# EAGLE design uMouse (EAGLE 9.3.0)
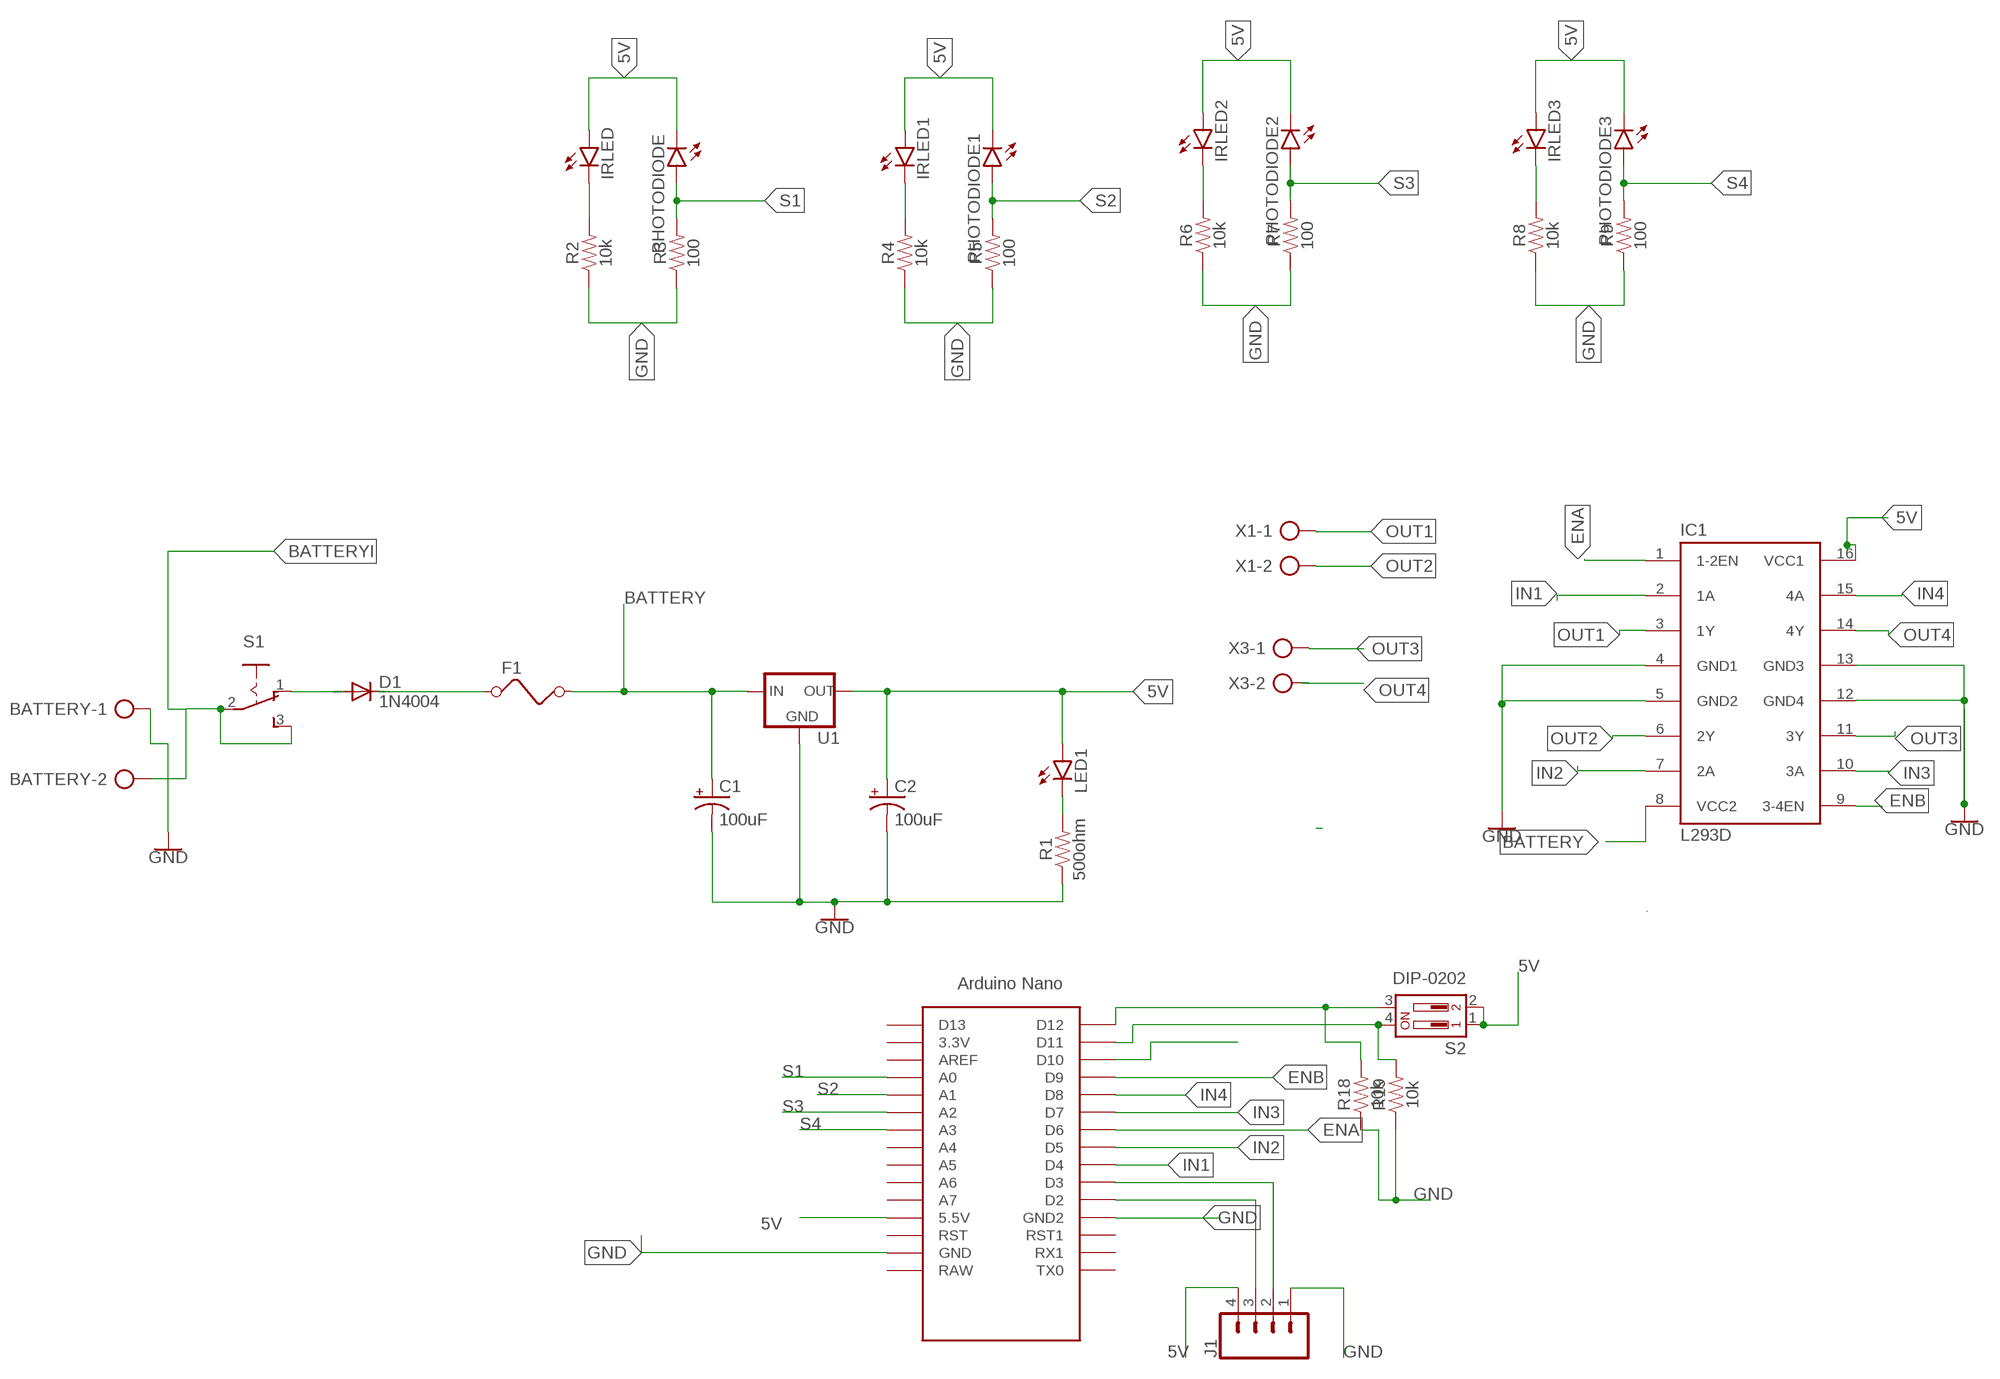
[diagram p0: schematic, sheet 1]

## Parts
BATTERY  AK500/2-H  [AK500/2-H]
C1  100uF  100UF-POLAR-RADIAL-2.5MM-25V-20%  [CPOL-RADIAL-2.5MM-6.5MM]
C2  100uF  100UF-POLAR-RADIAL-2.5MM-25V-20%  [CPOL-RADIAL-2.5MM-6.5MM]
D1  1N4004  [DO41-10]
F1  FUSE  [FUSE]
IC1  L293D  [DIL16]
IRLED  LED5MM  [LED5MM]
IRLED1  LED5MM  [LED5MM]
IRLED2  LED5MM  [LED5MM]
IRLED3  LED5MM  [LED5MM]
J1  CONN_04  [1X04]
LED1  LED3MM  [LED3MM]
PHOTODIODE  LED5MM  [LED5MM]
PHOTODIODE1  LED5MM  [LED5MM]
PHOTODIODE2  LED5MM  [LED5MM]
PHOTODIODE3  LED5MM  [LED5MM]
R1  500ohm  10MOHM-HORIZ-1/4W-5%  [AXIAL-0.3]
R2  10k  10MOHM-HORIZ-1/4W-5%  [AXIAL-0.3]
R3  100  10MOHM-HORIZ-1/4W-5%  [AXIAL-0.3]
R4  10k  10MOHM-HORIZ-1/4W-5%  [AXIAL-0.3]
R5  100  10MOHM-HORIZ-1/4W-5%  [AXIAL-0.3]
R6  10k  10MOHM-HORIZ-1/4W-5%  [AXIAL-0.3]
R7  100  10MOHM-HORIZ-1/4W-5%  [AXIAL-0.3]
R8  10k  10MOHM-HORIZ-1/4W-5%  [AXIAL-0.3]
R9  100  10MOHM-HORIZ-1/4W-5%  [AXIAL-0.3]
R18  10k  10MOHM-HORIZ-1/4W-5%  [AXIAL-0.3]
R19  10k  10MOHM-HORIZ-1/4W-5%  [AXIAL-0.3]
S1  255SB  [255SB]
S2  DIP-0202  [DIPSWITCH-02]
U1  78XXS  [78XXS]
U$2  NANO  [NANO]
X1  AK500/2-H  [AK500/2-H]
X3  AK500/2-H  [AK500/2-H]

## Nets
5V: C2.1(+) IC1.16(VCC1) IRLED1.A IRLED2.A IRLED3.A IRLED.A J1.4 LED1.A PHOTODIODE1.K(C) PHOTODIODE2.K(C) PHOTODIODE3.K(C) PHOTODIODE.K(C) S2.1 S2.2 U1.OUT U$2.5V(5.5V)
BATTERY: C1.1(+) F1.2 IC1.8(VCC2) U1.IN
BATTERYI: BATTERY.2 S1.2(P) S1.3(S)
ENA: IC1.1(1-2EN) U$2.D6
ENB: IC1.9(3-4EN) U$2.D9
GND: BATTERY.1 C1.2(-) C2.2(-) IC1.4(GND1) IC1.5(GND2) IC1.12(GND4) IC1.13(GND3) J1.1 R1.P$1 R2.P$1 R3.P$1 R4.P$1 R5.P$1 R6.P$1 R7.P$1 R8.P$1 R9.P$1 R18.P$1 R19.P$1 U1.GND U$2.GND U$2.GND1(GND2)
IN1: IC1.2(1A) U$2.D4
IN2: IC1.7(2A) U$2.D5
IN3: IC1.10(3A) U$2.D7
IN4: IC1.15(4A) U$2.D8
N$2: D1.A S1.1(O)
N$3: D1.C F1.1
N$4: IRLED1.K(C) R4.P$2
N$5: LED1.K(C) R1.P$2
N$6: IRLED.K(C) R2.P$2
N$7: U$2.D10
N$8: R19.P$2 S2.4 U$2.D11
N$9: R18.P$2 S2.3 U$2.D12
N$10: IRLED2.K(C) R6.P$2
N$11: IRLED3.K(C) R8.P$2
N$26: J1.3 U$2.D2
N$27: J1.2 U$2.D3
OUT1: IC1.3(1Y) X1.1
OUT2: IC1.6(2Y) X1.2
OUT3: IC1.11(3Y) X3.1
OUT4: IC1.14(4Y) X3.2
S1: PHOTODIODE.A R3.P$2 U$2.A0
S2: PHOTODIODE1.A R5.P$2 U$2.A1
S3: PHOTODIODE2.A R7.P$2 U$2.A2
S4: PHOTODIODE3.A R9.P$2 U$2.A3
Unconnected: U$2.3.3V U$2.A4 U$2.A5 U$2.A6 U$2.A7 U$2.AREF U$2.D13 U$2.ICSP1 U$2.ICSP2 U$2.ICSP3 U$2.ICSP4 U$2.ICSP5 U$2.ICSP6 U$2.RAW U$2.RST U$2.RST1 U$2.RX1 U$2.TX0

## Library data of the parts
BATTERY X1 X3 = con-ptr500:AK500/2-H: CONNECTOR Aug. 2004 / PTR Meßtechnik: Die Bezeichnung der Serie AK505 wurde geändert. Es handelt sich hierbei um AK500 in horizontaler Ausführung.; OC_FARNELL: unknown; OC_NEWARK: unknown
C1 C2 = SparkFun-Capacitors:100UF-POLAR: 100µF polarized capacitors A capacitor is a passive two-terminal electrical component used to store electrical energy temporarily in an electric field.; PROD_ID: CAP-08439
D1 = diode:1N4004: DIODE general purpose rectifier, 1 A
F1 = special:FUSE: FUSE 5 x 20 mm
IC1 = st-microelectronics:L293D: PUSH-PULL 4 CHANNEL DRIVER; MPN: L293D; OC_FARNELL: 9589619; OC_NEWARK: 56P8249
IRLED IRLED1-IRLED3 LED1 PHOTODIODE PHOTODIODE1-PHOTODIODE3 = led:LED: LED OSRAM: - CHIPLED LG R971, LG N971, LY N971, LG Q971, LY Q971, LO R971, LY R971 LH N974, LH R974 LS Q976, LO Q976, LY Q976 LO Q996 - Hyper CHIPLED LW Q18S LB Q993, LB Q99A, LB R99A - SideLED LS A670, LO A670, LY A670, LG A670, LP A670 LB A673, LV A673, LT A673, LW A673 LH A674 LY A675 LS A676, LA A676, LO A676, LY A676, LW A676 LS A679, LY A679, LG A679 - Hyper Micro SIDELED® LS Y876, LA Y876, LO Y876, LY Y876 LT Y87S - SmartLED LW L88C, LW L88S LB L89C, LB L89S, LG L890 LS L89K, LO L89K, LY L89K LS L896, LA L896, LO L896, LY L896 - TOPLED LS T670, LO T670, LY T670, LG T670, LP T670 LSG T670, LSP T670, LSY T670, LOP T670, LYG T670 LG T671, LOG T671, LSG T671 LB T673, LV T673, LT T673, LW T673 LH T674 LS T676, LA T676, LO T676, LY T676, LB T676, LH T676, LSB T676, LW T676 LB T67C, LV T67C, LT T67C, LS T67K, LO T67K, LY T67K, LW E67C LS E67B, LA E67B, LO E67B, LY E67B, LB E67C, LV E67C, LT E67C LW T67C LS T679, LY T679, LG T679 LS T770, LO T770, LY T770, LG T770, LP T770 LB T773, LV T773, LT T773, LW T773 LH T774 LS E675, LA E675, LY E675, LS T675 LS T776, LA T776, LO T776, LY T776, LB T776 LHGB T686 LT T68C, LB T68C - Hyper Mini TOPLED® LB M676 - Mini TOPLED Santana® LG M470 LS M47K, LO M47K, LY M47K Source: http://www.osram.convergy.de LUXEON: - LUMILED® LXK2-PW12-R00, LXK2-PW12-S00, LXK2-PW14-U00, LXK2-PW14-V00 LXK2-PM12-R00, LXK2-PM12-S00, LXK2-PM14-U00 LXK2-PE12-Q00, LXK2-PE12-R00, LXK2-PE12-S00, LXK2-PE14-T00, LXK2-PE14-U00 LXK2-PB12-K00, LXK2-PB12-L00, LXK2-PB12-M00, LXK2-PB14-N00, LXK2-PB14-P00, LXK2-PB14-Q00 LXK2-PR12-L00, LXK2-PR12-M00, LXK2-PR14-Q00, LXK2-PR14-R00 LXK2-PD12-Q00, LXK2-PD12-R00, LXK2-PD12-S00 LXK2-PH12-R00, LXK2-PH12-S00 LXK2-PL12-P00, LXK2-PL12-Q00, LXK2-PL12-R00 Source: www.luxeon.com KINGBRIGHT: KA-3528ASYC Source: www.kingbright.com
J1 = SparkFun-Connectors:CONN_04: Multi connection point. Often used as Generic Header-pin footprint for 0.1 inch spaced/style header connections On any of the 0.1 inch spaced packages, you can populate with these: Break Away Headers - Straight <https://www.sparkfun.com/products/116> (PRT-00116) Break Away Male Headers - Right Angle <https://www.sparkfun.com/products/553> (PRT-00553) Female Headers <https://www.sparkfun.com/products/115> (PRT-00115) Break Away Headers - Machine Pin <https://www.sparkfun.com/products/117> (PRT-00117) Break Away Female Headers - Swiss Machine Pin <https://www.sparkfun.com/products/743> (PRT-00743) For SCREWTERMINALS and SPRING TERMINALS visit here: Screw Terimnals on SparkFun.com <https://www.sparkfun.com/search/results?term=Screw+Terminals> (5mm/3.5mm/2.54mm spacing) This device is also useful as a general connection point to wire up your design to another part of your project. Our various solder wires solder well into these plated through hole pads. Hook-Up Wire - Assortment (Stranded, 22 AWG) <https://www.sparkfun.com/products/11375> (PRT-11375) Hook-Up Wire - Assortment (Solid Core, 22 AWG) <https://www.sparkfun.com/products/11367> (PRT-11367) View the entire wire category on our website here <https://www.sparkfun.com/categories/141> Special notes: Molex polarized connector foot print use with SKU : PRT-08231 with associated crimp pins and housings. 1MM SMD Version SKU: PRT-10208; PROD_ID: CONN-09696
R1-R9 R18 R19 = SparkFun-Resistors:10MOHM: RES-09327; PROD_ID: RES-09327; VALUE: 10M
S1 = switch:255SB: SLIDING SWITCH Distributor Buerklin, 11G810
S2 = SparkFun-Retired:DIP-02: SMD dip switch 2 positions
U1 = v-reg:78XXS: VOLTAGE REGULATOR
U$2 = Arduino-clone:NANO: Arduino Nano

## Board
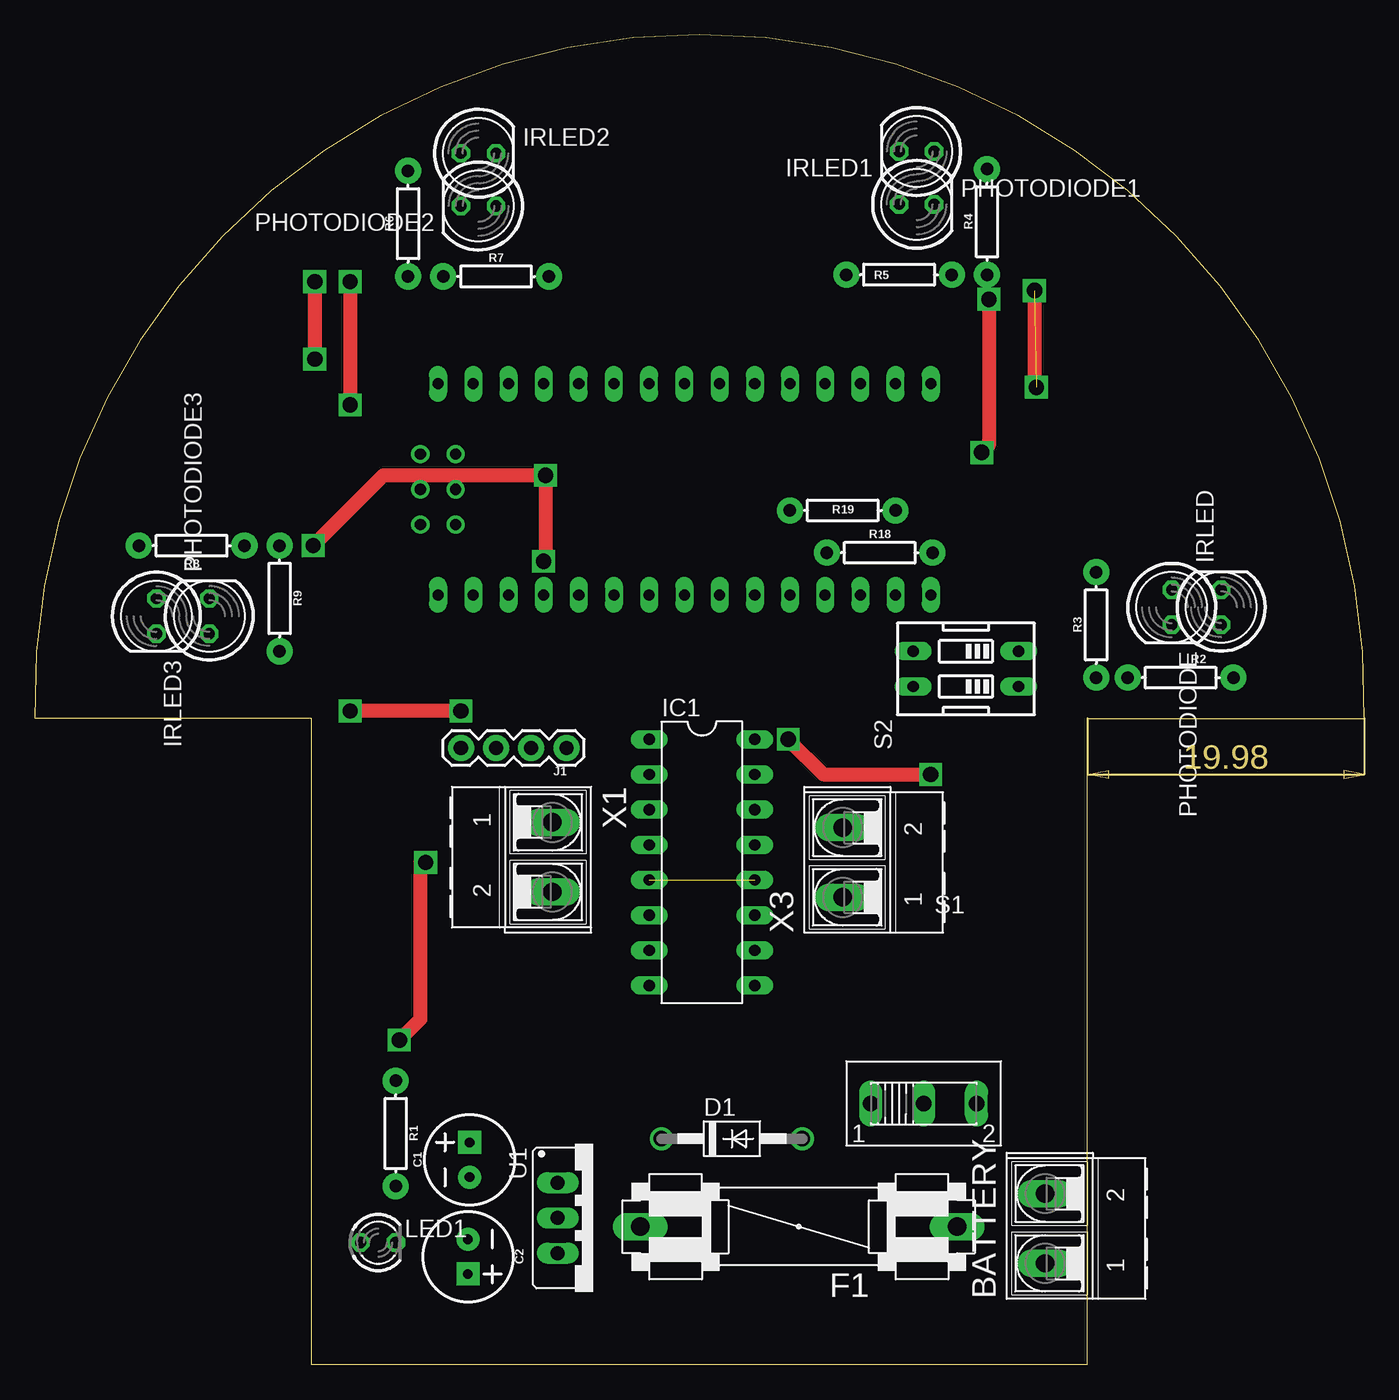
[diagram p1: board, top side]
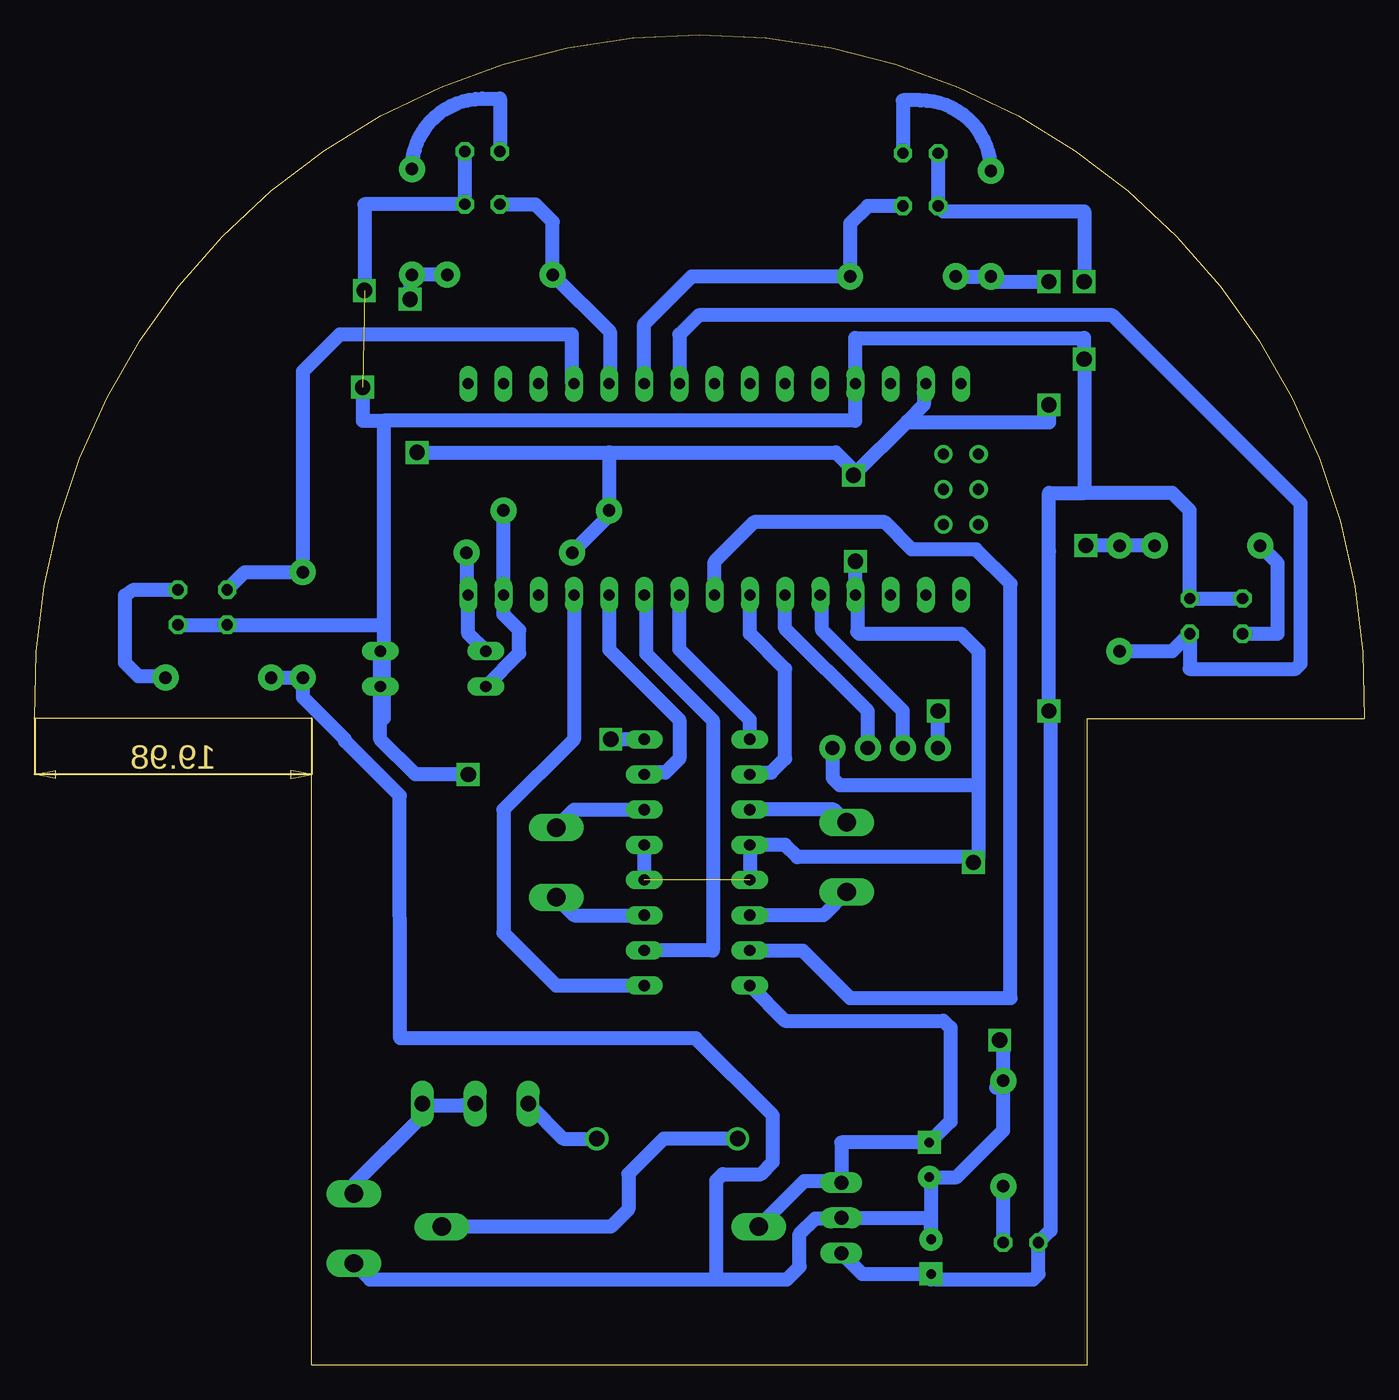
[diagram p2: board, bottom side, seen from below]

Size 95.96 x 96 mm. Coordinates in mm from the lower left corner, seen from the top.
Outline: 19.98,0 19.98,46.66 0,46.66 arc-183 95.96,46.66 75.98,46.66 75.98,0 19.98,0
Copper layers (1*16): Top 0.035mm / dielectric 1.5mm / Bottom 0.035mm
Design rules "default *": minimum track width 1mm, minimum drill 0.35mm, track to track 0.6mm, track to pad 1mm, pad to pad 6mil, via to via 6mil, smd to smd 6mil, copper to edge 40mil, drill to drill 6mil, minimum pad ring 10mil, minimum via ring 8mil, stop-mask expansion 4mil, vias tented up to drill 0mil, thermal gap 10mil

### Footprints (pad centres in the part's own frame; a part is rotated, then mirrored left to right if it is on the bottom)
AK500/2-H = drill 1.321 long: 1 -2.515,0; 2 2.515,0
CPOL-RADIAL-2.5MM-6.5MM = drill 0.7 pad 1.651 square: 1 1.25,0 | drill 0.7 pad 1.651: 2 -1.25,0
DO41-10 = drill 1.118: A 5.08,0; C -5.08,0
FUSE = drill 1.321 long: 1 -11.43,0; 2 11.43,0
DIL16 = drill 0.813 long: 1 -8.89,-3.81; 2 -6.35,-3.81; 3 -3.81,-3.81; 4 -1.27,-3.81; 5 1.27,-3.81; 6 3.81,-3.81; 7 6.35,-3.81; 8 8.89,-3.81; 9 8.89,3.81; 10 6.35,3.81; 11 3.81,3.81; 12 1.27,3.81; 13 -1.27,3.81; 14 -3.81,3.81; 15 -6.35,3.81; 16 -8.89,3.81
LED5MM = drill 0.813 octagon: A -1.27,0; K 1.27,0
1X04 = drill 1.016 pad 1.88: 1 0,0; 2 2.54,0; 3 5.08,0; 4 7.62,0
LED3MM = drill 0.813 octagon: A -1.27,0; K 1.27,0
AXIAL-0.3 = drill 0.9 pad 1.88: P$1 -3.81,0; P$2 3.81,0
255SB = drill 1.118 long: 1 -3.81,0; 2 0,0; 3 3.81,0
DIPSWITCH-02 = drill 0.813 long: 1 -1.27,-3.81; 2 1.27,-3.81; 3 1.27,3.81; 4 -1.27,3.81
78XXS = drill 1.016 long: GND 0,-2.54; IN -2.54,-2.54; OUT 2.54,-2.54
NANO = drill 0.8 long: 3.3V -10.16,24.13; 5V -10.16,-1.27; A0 -10.16,19.05; A1 -10.16,16.51; A2 -10.16,13.97; A3 -10.16,11.43; A4 -10.16,8.89; A5 -10.16,6.35; A6 -10.16,3.81; A7 -10.16,1.27; AREF -10.16,21.59; D2 5.08,1.27; D3 5.08,3.81; D4 5.08,6.35; D5 5.08,8.89; D6 5.08,11.43; D7 5.08,13.97; D8 5.08,16.51; D9 5.08,19.05; D10 5.08,21.59; D11 5.08,24.13; D12 5.08,26.67; D13 -10.16,26.67; GND -10.16,-6.35; GND1 5.08,-1.27; RAW -10.16,-8.89; RST -10.16,-3.81; RST1 5.08,-3.81; RX1 5.08,-6.35; TX0 5.08,-8.89 | drill 0.8: ICSP1 -5.08,-10.16; ICSP2 -5.08,-7.62; ICSP3 -2.54,-10.16; ICSP4 -2.54,-7.62; ICSP5 0,-10.16; ICSP6 0,-7.62

### Placement (x,y rotation side)
BATTERY  72.92,9.84 90 top
C1  31.39,14.8 90 top
C2  31.27,7.81 270 top
D1  50.32,16.32 0 top
F1  55.14,9.97 180 top
IC1  48.16,36.26 270 top
IRLED  85.62,54.67 90 top
IRLED1  63.65,87.57 180 top
IRLED2  32.03,87.44 0 top
IRLED3  8.79,54.04 270 top
J1  38.38,44.51 180 top
LED1  24.79,8.83 0 top
PHOTODIODE  82.07,54.67 270 top
PHOTODIODE1  63.65,83.76 0 top
PHOTODIODE2  32.03,83.63 180 top
PHOTODIODE3  12.6,54.04 90 top
R1  26.06,16.7 270 top
R2  82.7,49.59 0 top
R3  76.61,53.4 90 top
R4  68.73,82.49 90 top
R5  62.38,78.68 180 top
R6  26.95,82.36 90 top
R7  33.3,78.55 0 top
R8  11.33,59.12 180 top
R9  17.68,55.31 270 top
R18  60.99,58.61 0 top
R19  58.32,61.66 0 top
S1  64.16,18.86 0 top
S2  67.21,50.23 90 top
U1  40.28,10.61 270 top
U$2  38,60.64 270 top
X1  37.36,36.64 270 top
X3  58.32,36.26 90 top

### Tracks (layer width: path | path; a pad name or v marks a point on that pad's centre or on a via)
5V  (via drill 1.1)  (1 unrouted)
  Top 1: v54.38,45.15 56.92,42.61 v64.67,42.61 | v30.76,47.18 v22.77,47.18 | v20.22,78.17 v20.22,72.58 | v72.16,77.53 72.16,70.68 v72.29,70.55
  Bottom 1: U1.OUT 36.24,6.56 C2.1 | 31.27,6.16 C2.1 | C2.1 30.87,6.16 23.9,6.16 23.52,6.54 LED1.A 22.64,9.71 22.64,47.05 v22.77,47.18 22.77,58.71 22.76,58.72 22.76,62.93 20.22,62.93 | S2.1 S2.2 | IC1.16 v54.38,45.15 54.51,45.15 | v64.67,42.61 68.48,42.61 71.02,45.15 S2.1 | 20.22,62.93 v20.22,72.58 20.22,74.11 36.73,74.11 U$2.5V 36.73,68.14 70.76,68.14 | J1.4 v30.76,47.18 | 70.76,53.4 70.76,46.67 71.02,46.93 S2.1 | IRLED.A PHOTODIODE.K | 81.81,53.4 PHOTODIODE.K | PHOTODIODE.K 70.76,53.4 | IRLED1.A PHOTODIODE1.K 72.16,83.76 v72.16,77.53 | IRLED2.A PHOTODIODE2.K 30.38,83.25 20.22,83.25 v20.22,78.17 | IRLED3.A PHOTODIODE3.K 12.6,61.66 13.87,62.93 20.22,62.93 | 70.76,68.14 70.76,53.4 | v72.29,70.55 72.29,68.14 70.76,68.14
BATTERY
  Bottom 1: F1.2 40.41,13.27 37.87,13.27 U1.IN 37.74,16.05 C1.1 29.87,17.57 29.87,24.32 30.38,24.83 41.81,24.83 IC1.8
BATTERYI
  Bottom 1: 65.05,18.73 67.84,18.73 S1.3 67.97,17.97 72.92,13.02 BATTERY.2 | 64.29,18.61 64.16,18.73 S1.2
ENA
  Bottom 1: IC1.1 44.35,46.55 49.43,51.63 U$2.D6
ENB
  Bottom 1: U$2.D9 57.05,45.15 62.13,40.07 62.13,31.18 58.32,27.37 IC1.9
GND  (via drill 1.1)  (1 unrouted)
  Top 1: v36.73,57.99 36.87,58.13 v36.87,64.2 25.17,64.2 v20.09,59.12 | v26.31,23.43 27.84,24.96 27.84,36.26 v28.21,36.26 | v22.76,78.17 v22.76,69.28 | v68.86,76.9 68.86,66.36 v68.35,65.85
  Bottom 1: 46.76,6.16 71.76,6.16 BATTERY.1 72.92,7.58 | 46.76,6.16 41.68,6.16 40.76,7.08 40.76,9.44 39.63,10.57 37.78,10.57 U1.GND 37.71,10.57 31.51,10.57 31.27,10.33 C2.2 31.27,13.42 C1.2 29.43,13.55 26.06,16.91 R1.P$1 | R1.P$1 26.57,20 | IC1.13 IC1.12 | IC1.5 IC1.4 41.81,37.53 40.92,36.64 28.59,36.64 | 28.59,36.64 27.84,36.64 27.84,41.85 | J1.1 38.38,42.36 37.87,41.85 27.84,41.85 | 27.84,41.85 27.84,51.5 29.11,52.77 36.46,52.77 36.59,52.9 36.59,55.42 U$2.GND1 v36.73,57.99 | U$2.GND 31.79,70.66 31.79,69.28 32.99,68.08 | 32.99,68.08 v36.87,64.2 36.87,64.58 38.14,65.85 54.51,65.85 | R18.P$1 54.51,61.28 R19.P$1 54.51,65.85 | R2.P$1 77.24,49.59 76.73,49.09 76.61,49.21 R3.P$1 76.61,48.2 73.56,45.15 73.56,45.02 69.61,41.08 69.58,23.58 48.26,23.58 42.68,18 42.68,14.64 43.56,13.76 46.31,13.76 46.76,13.31 46.76,6.16 | R5.P$1 R4.P$1 68.86,78.55 v68.86,76.9 | R7.P$1 R6.P$1 26.95,78.17 v22.76,78.17 | R8.P$1 R9.P$1 v20.09,59.12 20.22,59.12 | R1.P$1 26.06,23.56 26.57,23.56 26.44,23.43 v26.31,23.43 | v28.21,36.26 28.59,36.64 | v22.76,69.28 22.76,68.01 32.99,68.01 32.99,68.08 | v68.35,65.85 54.51,65.85
IN1
  Bottom 1: IC1.2 44.21,42.74 42.82,42.74 41.81,43.76 41.81,50.23 44.35,52.77 U$2.D4
IN2
  Bottom 1: IC1.7 40.54,29.91 37.11,26.48 25.54,26.48 25.54,56.38 28.02,58.85 32.65,58.85 34.61,60.81 44.04,60.81 46.89,57.96 U$2.D5
IN3
  Bottom 1: U$2.D7 51.83,55.42 51.83,51.33 47.02,46.52 47.02,29.91 IC1.10
IN4
  Bottom 1: U$2.D8 54.51,51.62 49.44,46.55 49.44,43.75 50.44,42.74 51.83,42.74 IC1.15
N$2
  Bottom 1: S1.1 57.81,16.32 D1.A
N$3
  Bottom 1: D1.C 50.57,16.32 53.11,13.78 53.11,11.24 54.38,9.97 F1.1
N$4
  Bottom 1: R4.P$2 arc90 63.65,91.38 62.38,91.38 IRLED1.K
N$5
  Bottom 1: LED1.K R1.P$2
N$6
  Bottom 1: R2.P$2 86.6,49.68 88.46,49.68 89.43,50.65 89.43,55.52 88.8,55.94 IRLED.K
N$8
  Bottom 1: S2.4 60.99,51.37 60.99,53.03 62.13,54.16 U$2.D11 R19.P$2
N$9
  Bottom 1: S2.3 64.67,52.77 U$2.D12 64.8,55.69 R18.P$2
N$10
  Bottom 1: R6.P$2 arc-90 32.03,91.25 33.3,91.25 IRLED2.K
N$11
  Bottom 1: IRLED3.K 6.25,52.77 6.25,57.85 R8.P$2
N$26
  Bottom 1: U$2.D2 39.13,55.42 39.13,53.03 33.3,47.2 J1.3
N$27
  Bottom 1: J1.2 35.84,47.18 41.81,53.15 U$2.D3
OUT1
  Bottom 1: X1.1 38.28,40.07 IC1.3
OUT2
  Bottom 1: X1.2 39.04,32.45 IC1.6
OUT3
  Bottom 1: X3.1 57.02,32.45 IC1.11
OUT4
  Bottom 1: X3.2 57.02,40.07 IC1.14
S1
  Bottom 1: R3.P$2 76.61,57.13 | 76.74,57.21 R3.P$2 | U$2.A0 57.19,70.94 57.19,74.36 73.94,74.36 76.61,71.69 R3.P$2 | PHOTODIODE.A 80.8,57.21 R3.P$2
S2
  Bottom 1: PHOTODIODE1.A 59.84,83.76 58.57,82.49 R5.P$2 54.44,74.55 54.44,70.87 U$2.A1
S3
  Bottom 1: PHOTODIODE2.A 35.84,83.63 37.11,82.36 R7.P$2 48.54,78.55 51.97,75.12 U$2.A2
S4
  Bottom 1: R9.P$2 13.87,51.5 PHOTODIODE3.A 12.6,50.23 4.98,50.23 4.6,50.61 4.6,62.17 18.19,75.76 48.03,75.76 49.43,74.36 U$2.A3